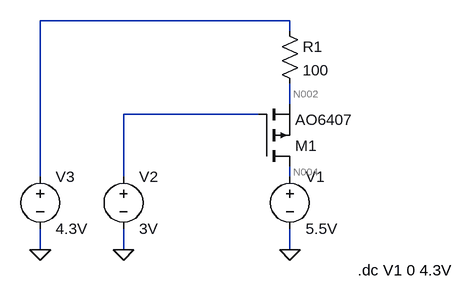
[diagram p0: schematic MOSCurrentSourceTest.asc]
MOSCurrentSourceTest.asc, the LTspice schematic file:
Version 4
SHEET 1 880 680
WIRE 400 192 16 192
WIRE 400 208 400 192
WIRE 400 320 400 288
WIRE 352 336 144 336
WIRE 16 432 16 192
WIRE 144 432 144 336
WIRE 400 432 400 416
WIRE 16 544 16 512
WIRE 144 544 144 512
WIRE 400 544 400 512
FLAG 400 544 0
FLAG 144 544 0
FLAG 16 544 0
SYMBOL voltage 400 416 R0
SYMATTR InstName V1
SYMATTR Value 5.5V
SYMBOL res 384 192 R0
SYMATTR InstName R1
SYMATTR Value 100
SYMBOL voltage 144 416 R0
SYMATTR InstName V2
SYMATTR Value 3V
SYMBOL pmos 352 416 M180
SYMATTR InstName M1
SYMATTR Value AO6407
SYMBOL voltage 16 416 R0
SYMATTR InstName V3
SYMATTR Value 4.3V
TEXT 504 576 Left 2 !.dc V1 0 4.3V

The netlist it stands for:
* MOSCurrentSourceTest.asc
V1 N004 0 5.5V
R1 N001 N002 100
V2 N003 0 3V
M1 N004 N003 N002 N002 AO6407
V3 N001 0 4.3V
.model NMOS NMOS
.model PMOS PMOS
.lib standard.mos
.dc V1 0 4.3V
.backanno
.end

* Results of the author's LTspice run, read from the files saved beside the schematic
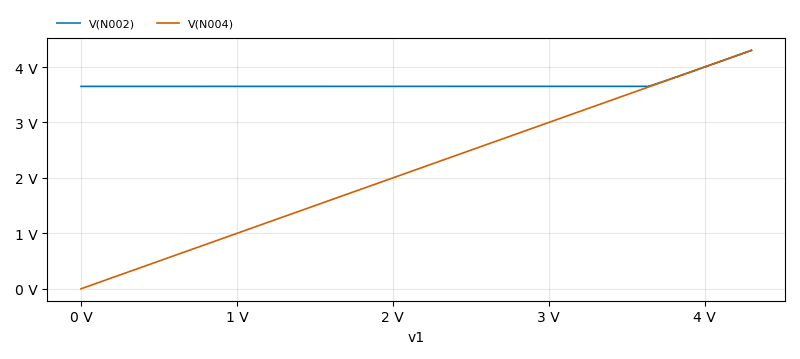
[diagram p1: DC transfer characteristic of MOSCurrentSourceTest.asc, plotted from the saved traces]
* DC transfer characteristic, 1 run:
*   V(N002): 3.65 V at v1=0 V, 4.3 V at v1=4.3 V, min 3.65 V, max 4.3 V
*   V(N004): 0 V at v1=0 V, 4.3 V at v1=4.3 V, min 0 V, max 4.3 V